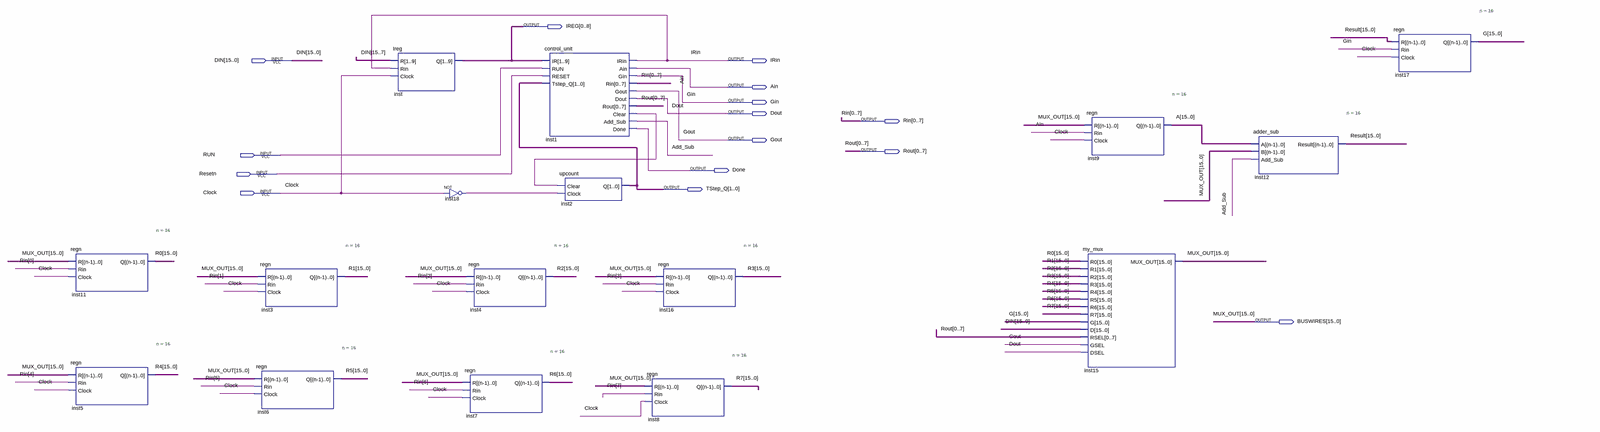
[diagram p0: schematic sheet, whole]
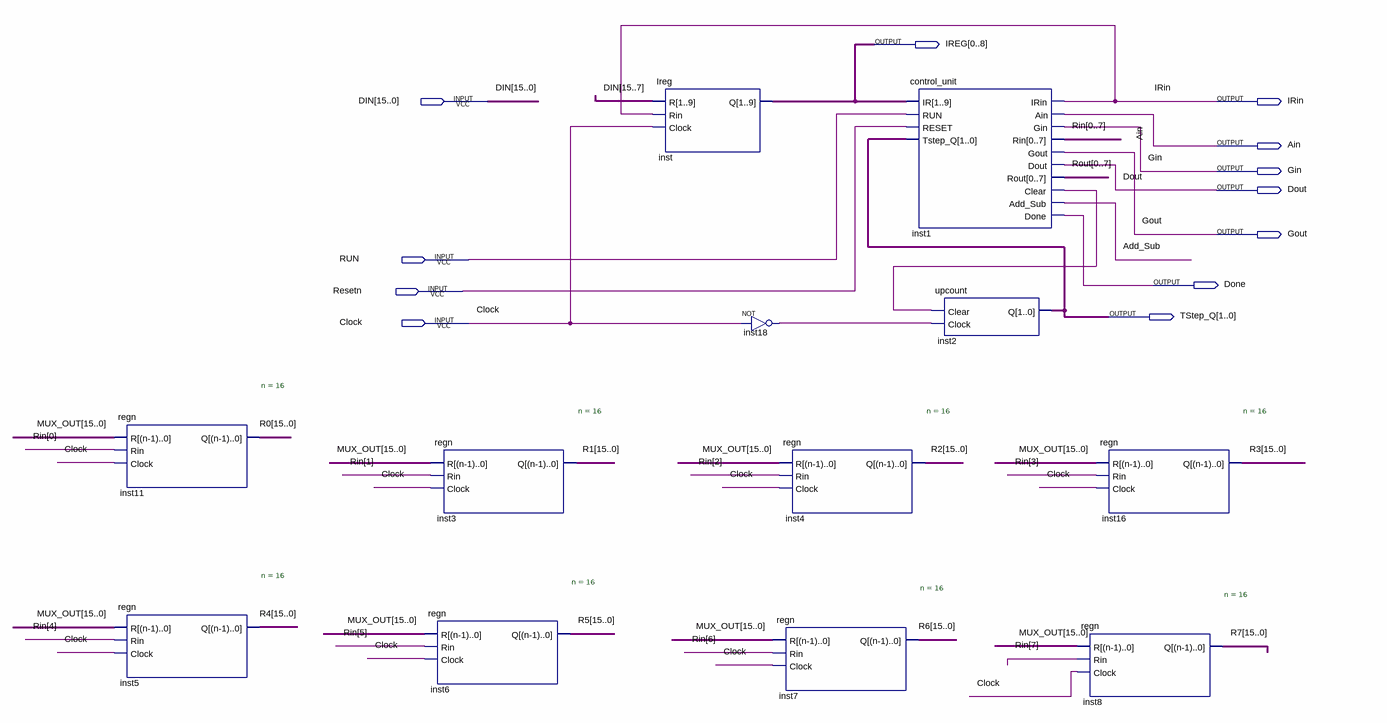
[diagram p1: schematic sheet, left part]
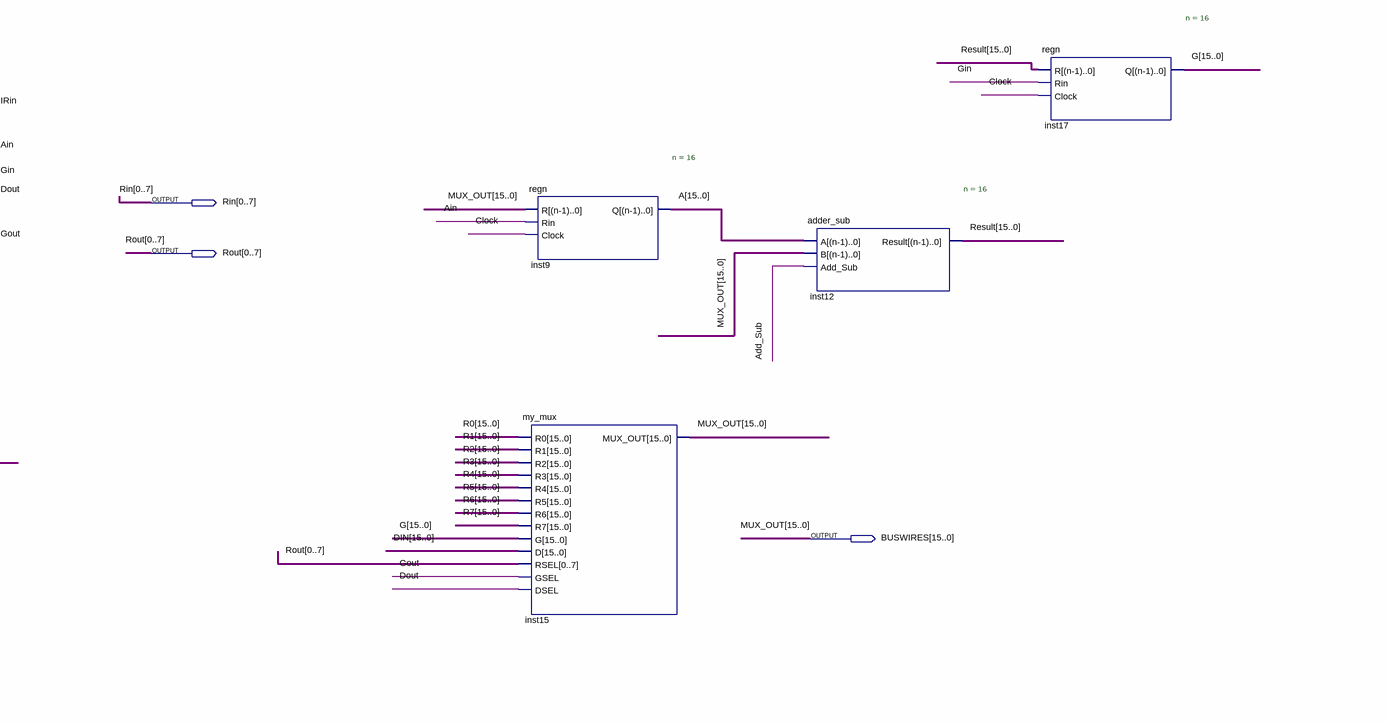
[diagram p2: schematic sheet, right part]
// Quartus schematic CPU_TEST.bdf as structural Verilog: 16 symbols, 15 pins
module CPU_TEST (
  input  [15:0] DIN,
  input  RUN,
  input  Resetn,
  input  Clock,
  output [0:8] IREG,
  output IRin,
  output Ain,
  output Gin,
  output Dout,
  output [0:7] Rin,
  output Gout,
  output [0:7] Rout,
  output Done,
  output [1:0] TStep_Q,
  output [15:0] BUSWIRES
);

  wire Add_Sub, inst1_clear, inst18_out;
  wire [15:0] A, G, R0, R1, R2, R3, R4, R5, R6, R7, Result;

  regn #(.n(16)) inst11 (.R(BUSWIRES), .Rin(Rin[0]), .Clock(Clock), .Q(R0));
  regn #(.n(16)) inst5 (.R(BUSWIRES), .Rin(Rin[4]), .Clock(Clock), .Q(R4));
  regn #(.n(16)) inst3 (.R(BUSWIRES), .Rin(Rin[1]), .Clock(Clock), .Q(R1));
  regn #(.n(16)) inst6 (.R(BUSWIRES), .Rin(Rin[5]), .Clock(Clock), .Q(R5));
  Ireg inst (.R(DIN[15:7]), .Rin(IRin), .Clock(Clock), .Q(IREG));
  not inst18 (inst18_out, Clock);
  regn #(.n(16)) inst4 (.R(BUSWIRES), .Rin(Rin[2]), .Clock(Clock), .Q(R2));
  regn #(.n(16)) inst7 (.R(BUSWIRES), .Rin(Rin[6]), .Clock(Clock), .Q(R6));
  control_unit inst1 (
    .IR(IREG), .RUN(RUN), .RESET(Resetn), .Tstep_Q(TStep_Q), .IRin(IRin), .Ain(Ain), .Gin(Gin), .Rin(Rin),
    .Gout(Gout), .Dout(Dout), .Rout(Rout), .Clear(inst1_clear), .Add_Sub(Add_Sub), .Done(Done));
  upcount inst2 (.Clear(inst1_clear), .Clock(inst18_out), .Q(TStep_Q));
  regn #(.n(16)) inst8 (.R(BUSWIRES), .Rin(Rin[7]), .Clock(Clock), .Q(R7));
  regn #(.n(16)) inst16 (.R(BUSWIRES), .Rin(Rin[3]), .Clock(Clock), .Q(R3));
  regn #(.n(16)) inst9 (.R(BUSWIRES), .Rin(Ain), .Clock(Clock), .Q(A));
  my_mux inst15 (
    .R0(R0), .R1(R1), .R2(R2), .R3(R3), .R4(R4), .R5(R5), .R6(R6), .R7(R7), .G(G), .D(DIN), .RSEL(Rout),
    .GSEL(Gout), .DSEL(Dout), .MUX_OUT(BUSWIRES));
  adder_sub #(.n(16)) inst12 (.A(A), .B(BUSWIRES), .Add_Sub(Add_Sub), .Result(Result));
  regn #(.n(16)) inst17 (.R(Result), .Rin(Gin), .Clock(Clock), .Q(G));

  // Other names for the same wires on the sheet: MUX_OUT[15:0] = BUSWIRES
endmodule
